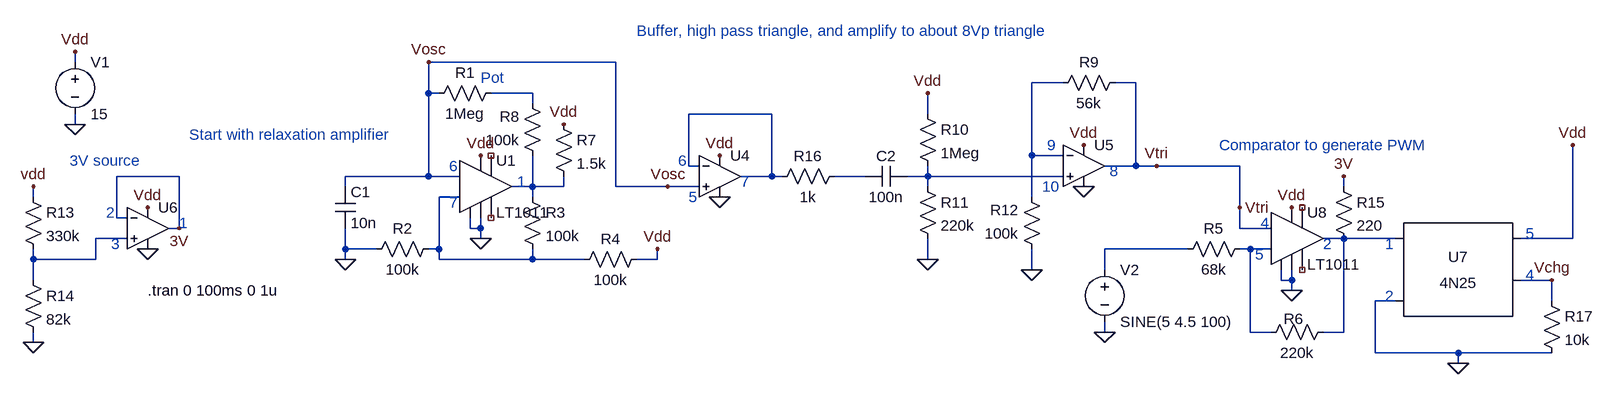
[diagram p0: schematic PWMtoOptoDevice.asc]
PWMtoOptoDevice.asc, the LTspice schematic file:
Version 4
SHEET 1 3656 680
WIRE -528 -64 -528 -80
WIRE 304 -64 16 -64
WIRE 992 -32 944 -32
WIRE 1104 -32 1072 -32
WIRE 16 -16 16 -64
WIRE 32 -16 16 -16
WIRE 176 -16 112 -16
WIRE 176 0 176 -16
WIRE 544 16 416 16
WIRE 784 16 784 -16
WIRE -528 32 -528 16
WIRE 944 80 944 -32
WIRE 992 80 944 80
WIRE 416 96 416 16
WIRE 432 96 416 96
WIRE 1104 96 1104 -32
WIRE 1104 96 1056 96
WIRE 1136 96 1104 96
WIRE 1264 96 1136 96
WIRE -368 112 -464 112
WIRE 16 112 16 -16
WIRE 16 112 -112 112
WIRE 64 112 16 112
WIRE 544 112 544 16
WIRE 544 112 496 112
WIRE 560 112 544 112
WIRE 688 112 640 112
WIRE 784 112 784 96
WIRE 784 112 752 112
WIRE 992 112 784 112
WIRE -112 128 -112 112
WIRE 176 128 176 80
WIRE 176 128 144 128
WIRE 224 128 224 112
WIRE 224 128 176 128
WIRE 304 128 304 -64
WIRE 384 128 304 128
WIRE 432 128 384 128
WIRE 784 128 784 112
WIRE 1424 128 1424 112
WIRE -592 144 -592 128
WIRE 64 144 32 144
WIRE 176 144 176 128
WIRE 944 144 944 80
WIRE 1264 160 1264 96
WIRE -464 176 -464 112
WIRE -448 176 -464 176
WIRE -368 192 -368 112
WIRE -368 192 -384 192
WIRE 80 192 80 176
WIRE 96 192 96 176
WIRE 96 192 80 192
WIRE 1264 192 1264 160
WIRE 1312 192 1264 192
WIRE -448 208 -496 208
WIRE 96 208 96 192
WIRE 1424 208 1392 208
WIRE 1504 208 1424 208
WIRE 1776 208 1776 64
WIRE 1776 208 1696 208
WIRE -112 224 -112 192
WIRE -64 224 -112 224
WIRE 32 224 32 144
WIRE 32 224 16 224
WIRE 1184 224 1056 224
WIRE 1280 224 1264 224
WIRE 1312 224 1280 224
WIRE -592 240 -592 224
WIRE -496 240 -496 208
WIRE -496 240 -592 240
WIRE -112 240 -112 224
WIRE 32 240 32 224
WIRE 176 240 176 224
WIRE 176 240 32 240
WIRE 256 240 176 240
WIRE 368 240 368 224
WIRE 368 240 336 240
WIRE 784 240 784 208
WIRE 944 256 944 224
WIRE 1056 256 1056 224
WIRE -592 272 -592 240
WIRE 1328 272 1328 256
WIRE 1344 272 1344 256
WIRE 1344 272 1328 272
WIRE 1744 272 1696 272
WIRE 1344 288 1344 272
WIRE 1504 304 1472 304
WIRE 1744 304 1744 272
WIRE 1056 352 1056 336
WIRE 1280 352 1280 224
WIRE 1312 352 1280 352
WIRE 1424 352 1424 208
WIRE 1424 352 1392 352
WIRE -592 368 -592 352
WIRE 1472 384 1472 304
WIRE 1600 384 1472 384
WIRE 1744 384 1600 384
WIRE 1600 400 1600 384
FLAG -528 32 0
FLAG -528 -80 Vdd
FLAG -112 240 0
FLAG 368 224 Vdd
FLAG 1344 160 Vdd
FLAG 1344 288 0
FLAG 1056 352 0
FLAG 464 144 0
FLAG 464 80 Vdd
FLAG 784 240 0
FLAG 784 -16 Vdd
FLAG 1024 128 0
FLAG 1024 64 Vdd
FLAG 944 256 0
FLAG 16 -64 Vosc
FLAG 384 128 Vosc
FLAG 1136 96 Vtri
FLAG 1264 160 Vtri
FLAG -416 160 Vdd
FLAG -416 224 0
FLAG -592 128 vdd
FLAG -592 368 0
FLAG -368 192 3V
FLAG 1424 112 3V
FLAG 1776 64 Vdd
FLAG 1600 400 0
FLAG 1744 272 Vchg
FLAG 96 80 Vdd
FLAG 96 208 0
FLAG 224 32 Vdd
SYMBOL voltage -528 -80 R0
WINDOW 123 0 0 Left 0
WINDOW 39 0 0 Left 0
SYMATTR InstName V1
SYMATTR Value 15
SYMBOL cap -128 128 R0
SYMATTR InstName C1
SYMATTR Value 10n
SYMBOL res 128 -32 R90
WINDOW 0 0 56 VBottom 2
WINDOW 3 32 56 VTop 2
SYMATTR InstName R1
SYMATTR Value 1Meg
SYMBOL res 32 208 R90
WINDOW 0 0 56 VBottom 2
WINDOW 3 32 56 VTop 2
SYMATTR InstName R2
SYMATTR Value 100k
SYMBOL res 160 128 R0
SYMATTR InstName R3
SYMATTR Value 100k
SYMBOL res 352 224 R90
WINDOW 0 0 56 VBottom 2
WINDOW 3 32 56 VTop 2
SYMATTR InstName R4
SYMATTR Value 100k
SYMBOL voltage 1056 240 R0
WINDOW 123 0 0 Left 0
WINDOW 39 0 0 Left 0
SYMATTR InstName V2
SYMATTR Value SINE(5 4.5 100)
SYMBOL res 1280 208 R90
WINDOW 0 0 56 VBottom 2
WINDOW 3 32 56 VTop 2
SYMATTR InstName R5
SYMATTR Value 68k
SYMBOL res 1408 336 R90
WINDOW 0 11 61 VBottom 2
WINDOW 3 32 56 VTop 2
SYMATTR InstName R6
SYMATTR Value 220k
SYMBOL OpAmps\\UniversalOpAmp2 464 112 R0
SYMATTR InstName U4
SYMBOL cap 752 96 R90
WINDOW 0 0 32 VBottom 2
WINDOW 3 32 32 VTop 2
SYMATTR InstName C2
SYMATTR Value 100n
SYMBOL res 768 0 R0
SYMATTR InstName R10
SYMATTR Value 1Meg
SYMBOL res 768 112 R0
SYMATTR InstName R11
SYMATTR Value 220k
SYMBOL OpAmps\\UniversalOpAmp2 1024 96 R0
SYMATTR InstName U5
SYMBOL res 1088 -48 R90
WINDOW 0 0 56 VBottom 2
WINDOW 3 32 56 VTop 2
SYMATTR InstName R9
SYMATTR Value 56k
SYMBOL res 960 240 R180
WINDOW 0 36 76 Left 2
WINDOW 3 36 40 Left 2
SYMATTR InstName R12
SYMATTR Value 100k
SYMBOL OpAmps\\UniversalOpAmp2 -416 192 R0
SYMATTR InstName U6
SYMBOL res -608 128 R0
SYMATTR InstName R13
SYMATTR Value 330k
SYMBOL res -608 256 R0
SYMATTR InstName R14
SYMATTR Value 82k
SYMBOL res 1408 112 R0
SYMATTR InstName R15
SYMATTR Value 220
SYMBOL Comparators\\LT1011 1344 208 R0
SYMATTR InstName U8
SYMBOL Optos\\4N25 1600 272 R0
SYMATTR InstName U7
SYMBOL res 656 96 R90
WINDOW 0 0 56 VBottom 2
WINDOW 3 32 56 VTop 2
SYMATTR InstName R16
SYMATTR Value 1k
SYMBOL Comparators\\LT1011 96 128 R0
SYMATTR InstName U1
SYMBOL res 208 16 R0
SYMATTR InstName R7
SYMATTR Value 1.5k
SYMBOL res 192 96 R180
WINDOW 0 36 76 Left 2
WINDOW 3 36 40 Left 2
SYMATTR InstName R8
SYMATTR Value 100k
SYMBOL res 1728 288 R0
SYMATTR InstName R17
SYMATTR Value 10k
TEXT -416 288 Left 2 !.tran 0 100ms 0 1u
TEXT -352 48 Left 2 ;Start with relaxation amplifier
TEXT 336 -112 Left 2 ;Buffer, high pass triangle, and amplify to about 8Vp triangle
TEXT 1232 64 Left 2 ;Comparator to generate PWM
TEXT -536 88 Left 2 ;3V source
TEXT -480 168 Left 2 ;2
TEXT -472 216 Left 2 ;3
TEXT -368 184 Left 2 ;1
TEXT 416 144 Left 2 ;5
TEXT 400 88 Left 2 ;6
TEXT 496 120 Left 2 ;7
TEXT 960 128 Left 2 ;10
TEXT 968 64 Left 2 ;9
TEXT 1064 104 Left 2 ;8
TEXT 48 152 Left 2 ;7
TEXT 48 96 Left 2 ;6
TEXT 152 120 Left 2 ;1
TEXT 1288 232 Left 2 ;5
TEXT 1296 184 Left 2 ;4
TEXT 1392 216 Left 2 ;2
TEXT 1488 216 Left 2 ;1
TEXT 1488 296 Left 2 ;2
TEXT 1704 200 Left 2 ;5
TEXT 1704 264 Left 2 ;4
TEXT 96 -40 Left 2 ;Pot

The netlist it stands for:
* PWMtoOptoDevice.asc
V1 Vdd 0 15
C1 Vosc 0 10n
R1 N002 Vosc 1Meg
R2 N007 0 100k
R3 N006 N007 100k
R4 Vdd N007 100k
V2 N010 0 SINE(5 4.5 100)
R5 N011 N010 68k
R6 N009 N011 220k
XU4 Vosc N003 Vdd 0 N003 level2 Avol=1Meg GBW=10Meg Slew=10Meg Ilimit=25m Rail=0 Vos=0 En=0 Enk=0 In=0 Ink=0 Rin=500Meg  ; pins In+ In- V+ V- OUT
C2 N005 N004 100n
R10 Vdd N005 1Meg
R11 N005 0 220k
XU5 N005 N001 Vdd 0 Vtri level2 Avol=1Meg GBW=10Meg Slew=10Meg Ilimit=25m Rail=0 Vos=0 En=0 Enk=0 In=0 Ink=0 Rin=500Meg  ; pins In+ In- V+ V- OUT
R9 Vtri N001 56k
R12 0 N001 100k
XU6 N008 3V Vdd 0 3V level2 Avol=1Meg GBW=10Meg Slew=10Meg Ilimit=25m Rail=0 Vos=0 En=0 Enk=0 In=0 Ink=0 Rin=500Meg  ; pins In+ In- V+ V- OUT
R13 Vdd N008 330k
R14 N008 0 82k
R15 3V N009 220
XU8 0 N011 Vtri 0 NC_01 NC_02 N009 Vdd LT1011
XU7 N009 0 Vdd Vchg NC_03 4N25
R16 N004 N003 1k
XU1 0 N007 Vosc 0 NC_04 NC_05 N006 Vdd LT1011
R7 Vdd N006 1.5k
R8 N006 N002 100k
R17 Vchg 0 10k
.tran 0 100ms 0 1u
* Start with relaxation amplifier
* Buffer, high pass triangle, and amplify to about 8Vp triangle
* Comparator to generate PWM
* 3V source
* 2
* 3
* 1
* 5
* 6
* 7
* 10
* 9
* 8
* 7
* 6
* 1
* 5
* 4
* 2
* 1
* 2
* 5
* 4
* Pot
.lib UniversalOpAmp2.lib
.lib LTC1.lib
.lib 4N25.sub
.backanno
.end